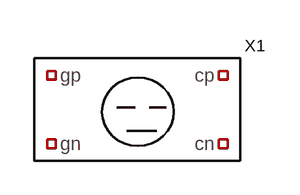
[diagram p0: schematic Draft6.asc]
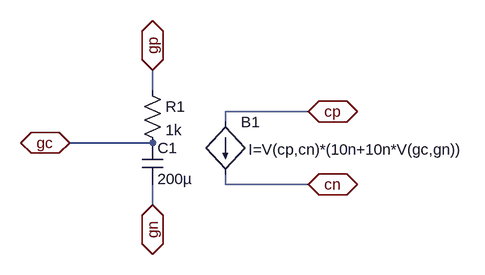
[diagram p1: sub-circuit capteur_graphite.asc]
Draft6.asc, the LTspice schematic file:
Version 4
SHEET 1 880 680
SYMBOL capteur_graphite 128 144 R0
SYMATTR InstName X1

capteur_graphite.asc, the sub-circuit schematic file:
Version 4
SHEET 1 880 680
WIRE 80 48 80 16
WIRE 320 80 192 80
WIRE 192 96 192 80
WIRE 80 128 -48 128
WIRE 192 192 192 176
WIRE 320 192 192 192
WIRE 80 224 80 192
FLAG 320 80 cp
IOPIN 320 80 BiDir
FLAG 320 192 cn
IOPIN 320 192 BiDir
FLAG 80 16 gp
IOPIN 80 16 BiDir
FLAG 80 224 gn
IOPIN 80 224 BiDir
FLAG -48 128 gc
IOPIN -48 128 BiDir
SYMBOL bi 192 96 R0
WINDOW 3 36 42 Left 2
SYMATTR InstName B1
SYMATTR Value I=V(cp,cn)*(10n+10n*V(gc,gn))
SYMBOL res 64 32 R0
SYMATTR InstName R1
SYMATTR Value 1k
SYMBOL cap 64 128 R0
SYMATTR InstName C1
SYMATTR Value 200µ

The netlist it stands for:
* Draft6.asc
XX1 NC_01 NC_02 NC_03 NC_04 capteur_graphite

* block symbol definitions
.subckt capteur_graphite cp cn gp gn
B1 cp cn I=V(cp,cn)*(10n+10n*V(gc,gn))
R1 gp gc 1k
C1 gc gn 200µ
.ends capteur_graphite

.backanno
.end